# EAGLE design wespi-nano_3 (EAGLE 7.6.0)
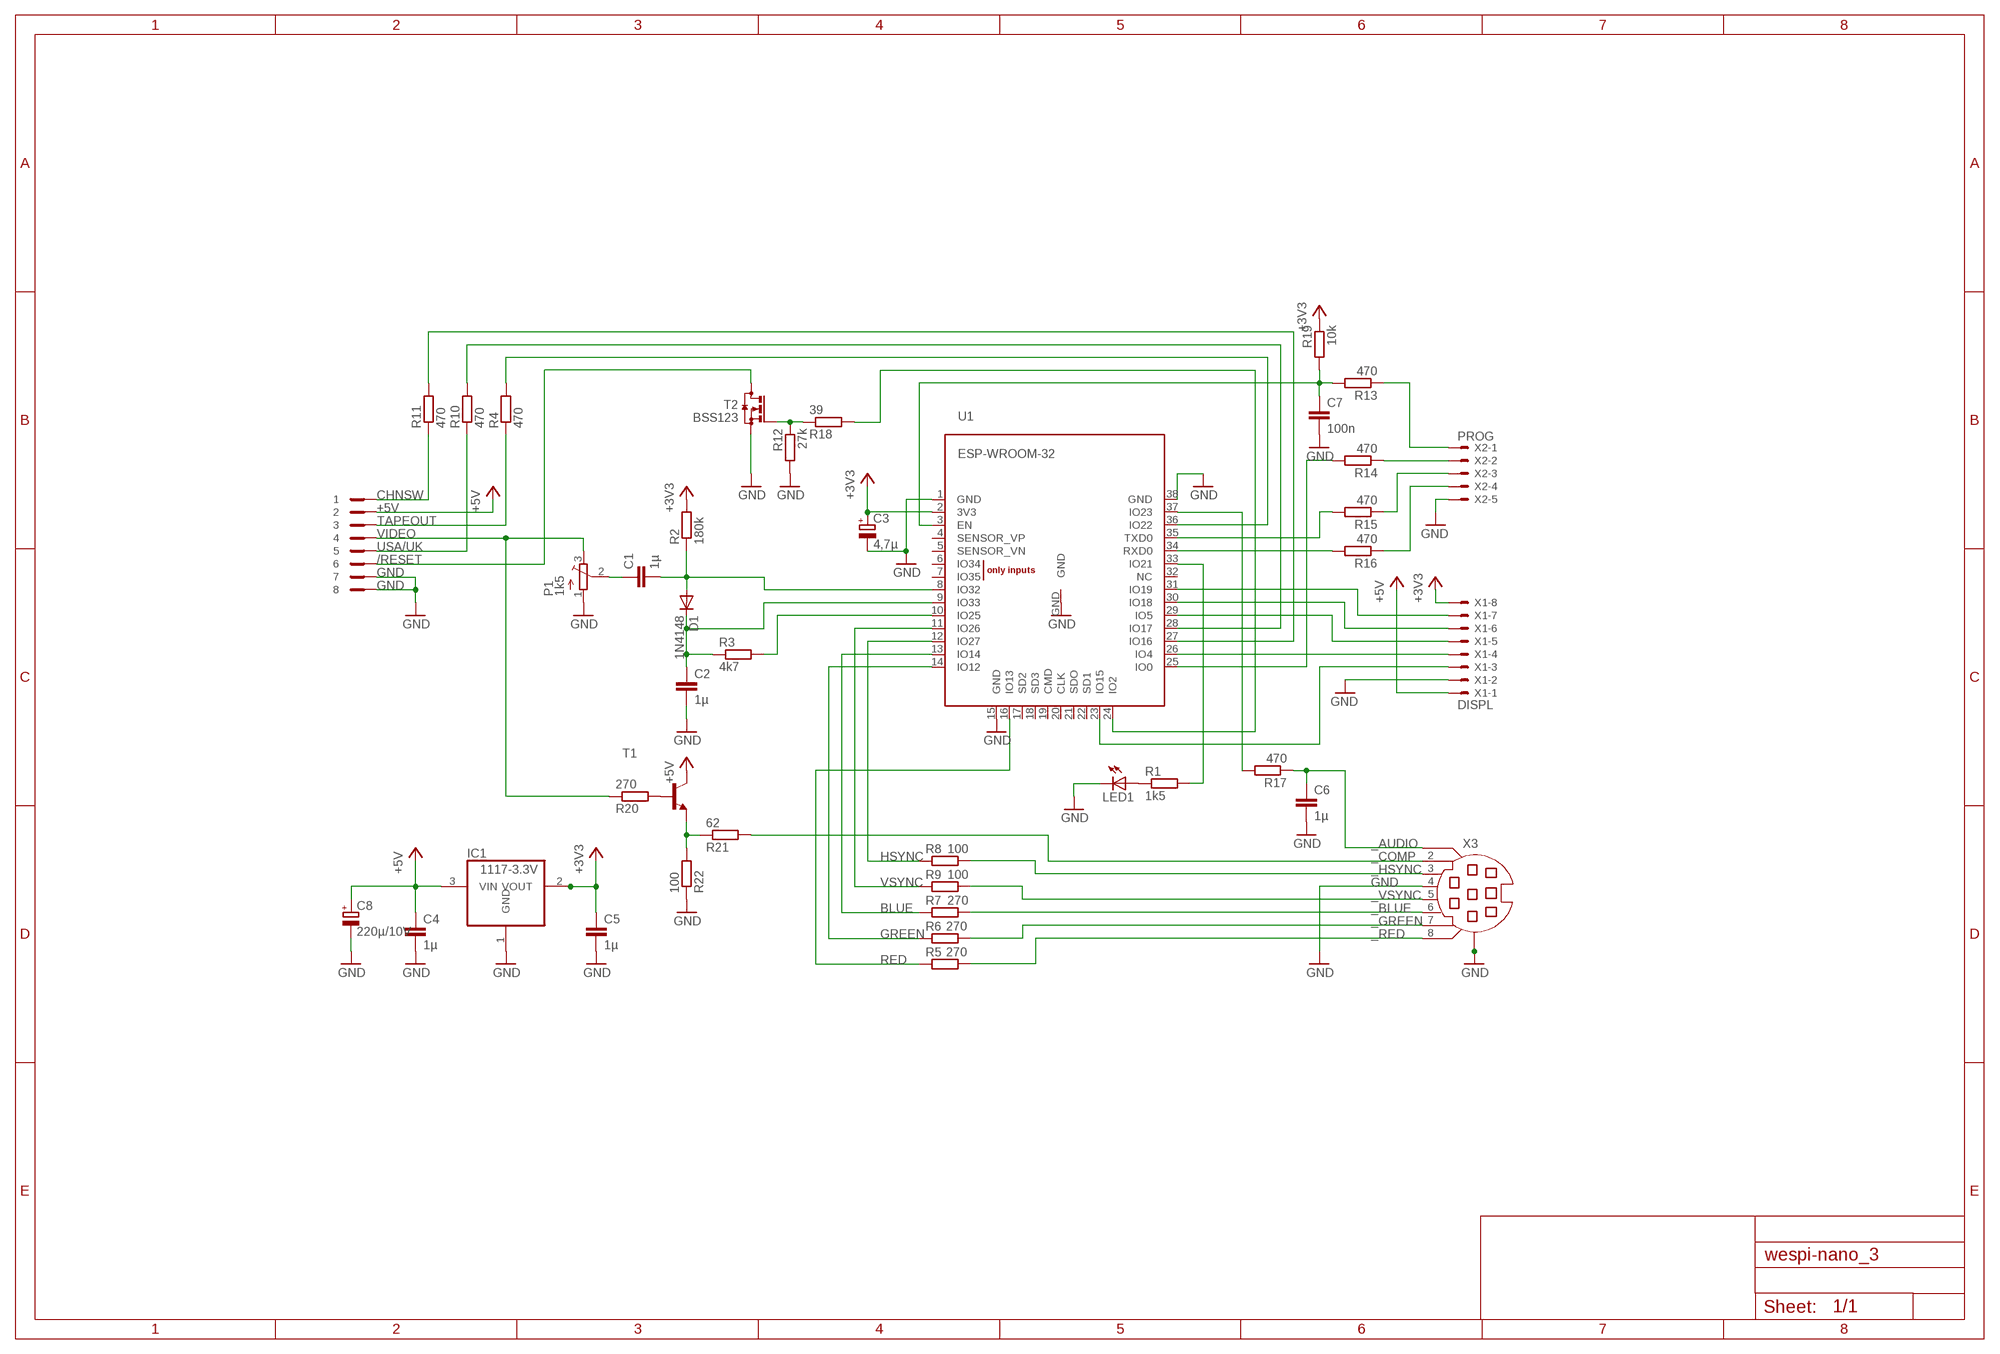
[diagram p0: schematic, sheet 1]

## Parts
C1  1µ  C-EUC0805  [C0805]
C2  1µ  C-EUC0805  [C0805]
C3  4,7µ  CPOL-EU153CLV-0405  [153CLV-0405]
C4  1µ  C-EUC0805  [C0805]
C5  1µ  C-EUC0805  [C0805]
C6  1µ  C-EUC0805  [C0805]
C7  100n  C-EUC0805  [C0805]
C8  220µ/10V  CPOL-EUE2.5-6  [E2,5-6]
D1  1N4148  CGRM4001-G  [SOD-123_MINI-SMA]
IC1  1117-3.3V  REG1117  [SOT223]
K6  PINHEAD-2X4  [PINHEAD2X4]
LED1  LEDSML0805  [SML0805]
P1  1k5  TRIM_EU-3223G  [3223G]
R1  1k5  R-EU_R0805  [R0805]
R2  180k  R-EU_R0805  [R0805]
R3  4k7  R-EU_R0805  [R0805]
R4  470  R-EU_R0805  [R0805]
R5  270  R-EU_R0805  [R0805]
R6  270  R-EU_R0805  [R0805]
R7  270  R-EU_R0805  [R0805]
R8  100  R-EU_R0805  [R0805]
R9  100  R-EU_R0805  [R0805]
R10  470  R-EU_R0805  [R0805]
R11  470  R-EU_R0805  [R0805]
R12  27k  R-EU_R0805  [R0805]
R13  470  R-EU_R0805  [R0805]
R14  470  R-EU_R0805  [R0805]
R15  470  R-EU_R0805  [R0805]
R16  470  R-EU_R0805  [R0805]
R17  470  R-EU_R0805  [R0805]
R18  39  R-EU_R0805  [R0805]
R19  10k  R-EU_R0805  [R0805]
R20  270  R-EU_R0805  [R0805]
R21  62  R-EU_R0805  [R0805]
R22  100  R-EU_R0805  [R0805]
T1  BC847-NPN-SOT23-BEC  [SOT23-BEC]
T2  BSS123  [SOT23]
U1  ESP-WROOM-32  [ESP-WROOM-32]
X1  DISPL  53047-08  [53047-08]
X2  PROG  53047-05  [53047-05]
X3  MINI-DIN-8  [MINI-DIN-8]

## Nets
+3V3: C3.+ C5.1 IC1.2(VOUT) IC1.4(VOUT1) R2.2 R19.1 U1.2(3V3) X1.8
+5V: C4.1 C8.+ IC1.3(VIN) K6.2 T1.C X1.1
/RESET: K6.6 T2.3(D)
_AUDIO: C6.1 R17.1 X3.1
_BLUE: R7.2 X3.6
_COMP: R21.2 X3.2
_GREEN: R6.2 X3.7
_HSYNC: R8.2 X3.3
_RED: R5.2 X3.8
_RESET: R13.1 X2.1
_RXD: R16.1 X2.4
_TXD: R15.1 X2.3
_VSYNC: R9.2 X3.5
BLUE: R7.1 U1.13(IO14)
BOOT0: R14.1 X2.2
CHNSW: K6.1 R11.1
GND: C2.2 C3.- C4.2 C5.2 C6.2 C7.2 C8.- IC1.1(GND) K6.7 K6.8 LED1.C P1.1(A) R12.2 R22.1 T2.2(S) U1.1(GND) U1.15(GND) U1.38(GND) U1.GND X1.2 X2.5 X3.4 X3.G1(G2) X3.G2(G3) X3.G(G1)
GREEN: R6.1 U1.14(IO12)
HSYNC: R8.1 U1.12(IO27)
IO0: R14.2 U1.25(IO0)
N$1: K6.3 R4.1
N$2: U1.23(IO15) X1.3
N$3: C1.2 D1.A R2.1 U1.8(IO32)
N$4: C2.1 D1.C R3.1 U1.9(IO33)
N$5: R3.2 U1.10(IO25)
N$6: R20.2 T1.B
N$7: R21.1 R22.2 T1.E
N$8: LED1.A R1.1
N$9: C1.1 P1.2(S)
N$10: R1.2 U1.33(IO21)
N$11: R18.2 U1.24(IO2)
N$12: U1.26(IO4) X1.4
N$13: R10.2 U1.28(IO17)
N$14: R11.2 U1.27(IO16)
N$15: U1.29(IO5) X1.5
N$16: U1.30(IO18) X1.6
N$17: U1.31(IO19) X1.7
N$26: R12.1 R18.1 T2.1(G)
N$27: R17.2 U1.37(IO23)
RED: R5.1 U1.16(IO13)
RESET: C7.1 R13.2 R19.2 U1.3(EN)
RXD0: R16.2 U1.34(RXD0)
TAPEOUT: R4.2 U1.36(IO22)
TXD0: R15.2 U1.35(TXD0)
USA/UK: K6.5 R10.1
VIDEO: K6.4 P1.3(E) R20.1
VSYNC: R9.1 U1.11(IO26)
Unconnected: U1.4(SENSOR_VP) U1.5(SENSOR_VN) U1.6(IO34) U1.7(IO35) U1.17(SD2) U1.18(SD3) U1.19(CMD) U1.20(CLK) U1.21(SDO) U1.22(SD1) U1.32(NC)

## Library data of the parts
C1 C2 C4-C7 = Thorsten_rcl:C-EU: CAPACITOR, European symbol
C3 = Thorsten_rcl:CPOL-EU: POLARIZED CAPACITOR, European symbol
C8 = rcl:CPOL-EU: POLARIZED CAPACITOR, European symbol
D1 = diode:CGRM400*-G: Molded plasitc,JEDEC SOD-123/Mini SMA Source: Comchip CGRM4001-G.pdf
IC1 = Thorsten_IC:REG1117
K6 = sinclair:PINHEAD-2X4
LED1 = led:LED: LED OSRAM: - CHIPLED LG R971, LG N971, LY N971, LG Q971, LY Q971, LO R971, LY R971 LH N974, LH R974 LS Q976, LO Q976, LY Q976 LO Q996 - Hyper CHIPLED LW Q18S LB Q993, LB Q99A, LB R99A - SideLED LS A670, LO A670, LY A670, LG A670, LP A670 LB A673, LV A673, LT A673, LW A673 LH A674 LY A675 LS A676, LA A676, LO A676, LY A676, LW A676 LS A679, LY A679, LG A679 - Hyper Micro SIDELED® LS Y876, LA Y876, LO Y876, LY Y876 LT Y87S - SmartLED LW L88C, LW L88S LB L89C, LB L89S, LG L890 LS L89K, LO L89K, LY L89K LS L896, LA L896, LO L896, LY L896 - TOPLED LS T670, LO T670, LY T670, LG T670, LP T670 LSG T670, LSP T670, LSY T670, LOP T670, LYG T670 LG T671, LOG T671, LSG T671 LB T673, LV T673, LT T673, LW T673 LH T674 LS T676, LA T676, LO T676, LY T676, LB T676, LH T676, LSB T676, LW T676 LB T67C, LV T67C, LT T67C, LS T67K, LO T67K, LY T67K, LW E67C LS E67B, LA E67B, LO E67B, LY E67B, LB E67C, LV E67C, LT E67C LW T67C LS T679, LY T679, LG T679 LS T770, LO T770, LY T770, LG T770, LP T770 LB T773, LV T773, LT T773, LW T773 LH T774 LS E675, LA E675, LY E675, LS T675 LS T776, LA T776, LO T776, LY T776, LB T776 LHGB T686 LT T68C, LB T68C - Hyper Mini TOPLED® LB M676 - Mini TOPLED Santana® LG M470 LS M47K, LO M47K, LY M47K Source: http://www.osram.convergy.de LUXEON: - LUMILED® LXK2-PW12-R00, LXK2-PW12-S00, LXK2-PW14-U00, LXK2-PW14-V00 LXK2-PM12-R00, LXK2-PM12-S00, LXK2-PM14-U00 LXK2-PE12-Q00, LXK2-PE12-R00, LXK2-PE12-S00, LXK2-PE14-T00, LXK2-PE14-U00 LXK2-PB12-K00, LXK2-PB12-L00, LXK2-PB12-M00, LXK2-PB14-N00, LXK2-PB14-P00, LXK2-PB14-Q00 LXK2-PR12-L00, LXK2-PR12-M00, LXK2-PR14-Q00, LXK2-PR14-R00 LXK2-PD12-Q00, LXK2-PD12-R00, LXK2-PD12-S00 LXK2-PH12-R00, LXK2-PH12-S00 LXK2-PL12-P00, LXK2-PL12-Q00, LXK2-PL12-R00 Source: www.luxeon.com KINGBRIGHT: KA-3528ASYC Source: www.kingbright.com
P1 = pot:TRIM_EU-: POTENTIOMETER
R1-R22 = Thorsten_rcl:R-EU_: RESISTOR, European symbol
T1 = transistor:*-NPN-: NPN Transistror BF959 corrected 2008.03.06
T2 = transistor-small-signal:BSS123: N-CHANNEL MOS FET
U1 = esp32:ESP-WROOM-32
X1 = con-molex:53?-08: CONNECTOR wire to board 1.25 mm (.049 inch) pitch header; MPN: 53047-0810; OC_FARNELL: 1012258; OC_NEWARK: 98K9826
X2 = con-molex:53?-05: CONNECTOR wire to board 1.25 mm (.049 inch) pitch header; MF: MOLEX; MPN: 53047-0510; OC_FARNELL: 9732861; OC_NEWARK: 38C9901
X3 = sinclair:MINI-DIN-8

## Board
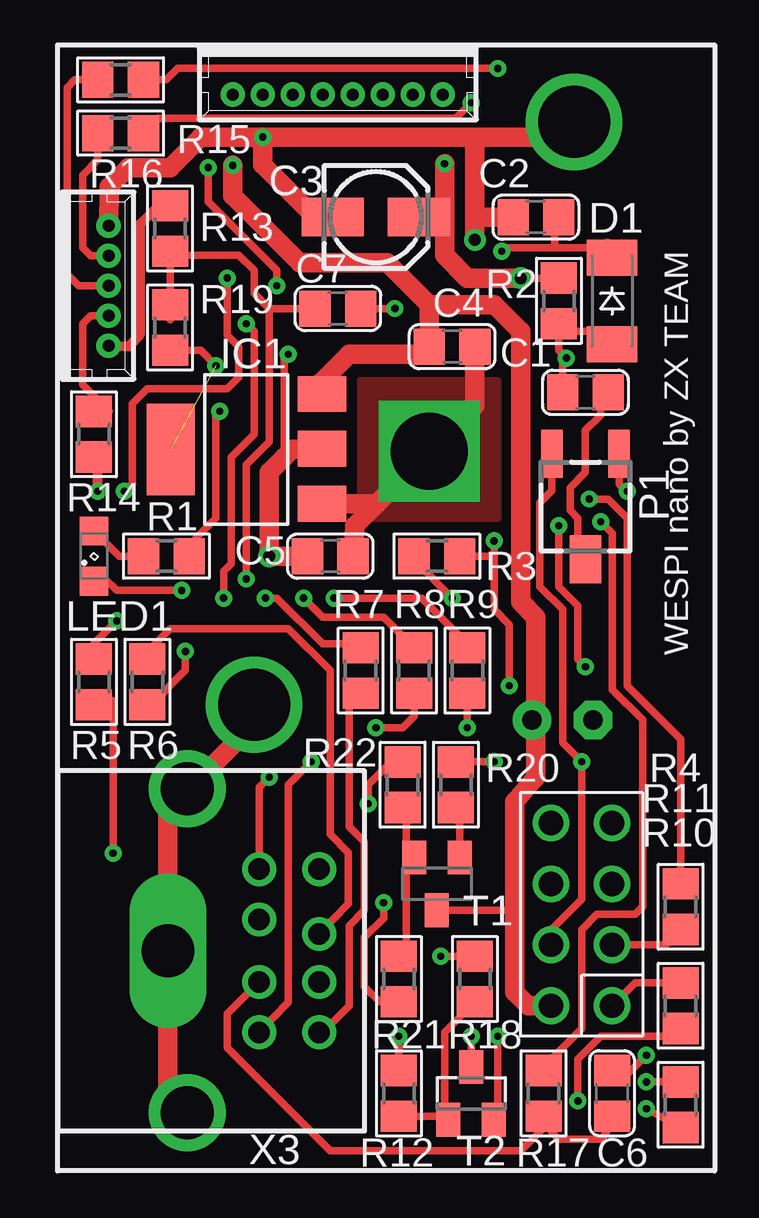
[diagram p1: board, top side]
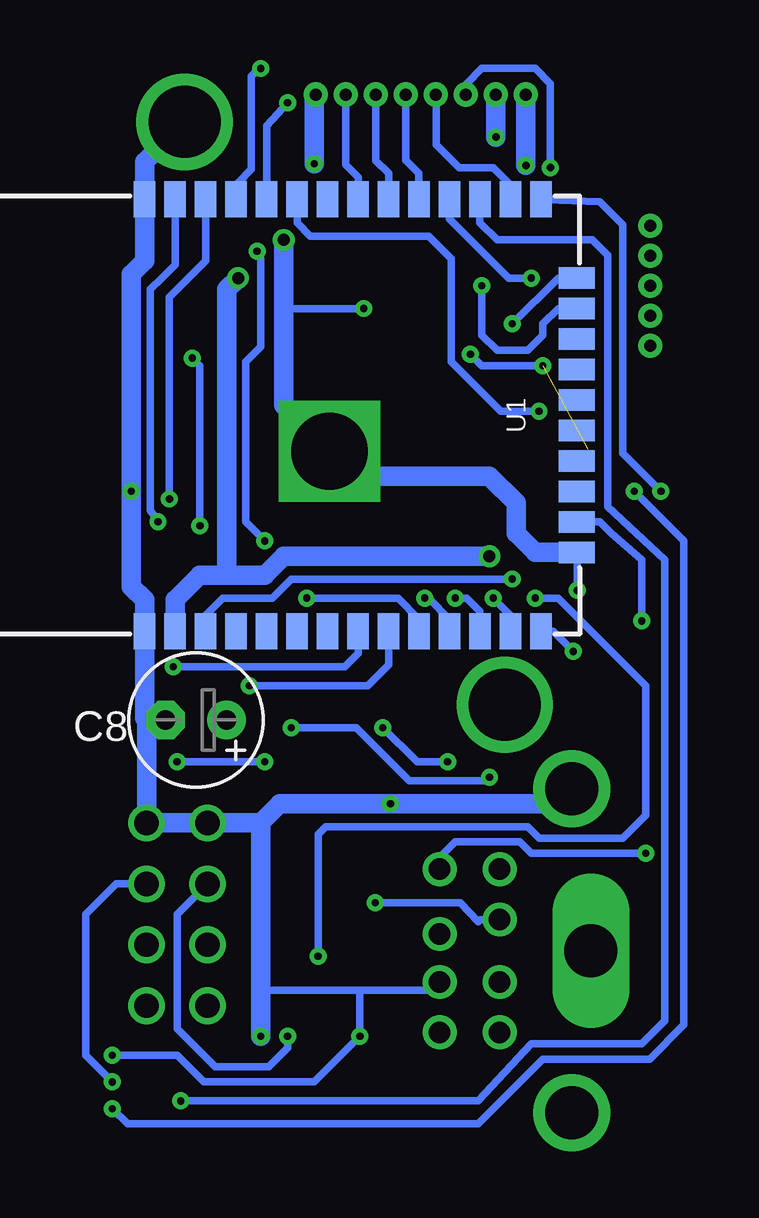
[diagram p2: board, bottom side, seen from below]

No outline drawn. Coordinates in mm, seen from the top.
Copper layers (1*16): Top 0.035mm / dielectric 1.5mm / Bottom 0.035mm
Design rules "default *": minimum track width 10mil, minimum drill 0.3mm, track to track 8mil, track to pad 8mil, pad to pad 8mil, via to via 8mil, smd to smd 8mil, copper to edge 40mil, drill to drill 8mil, minimum pad ring 10mil, minimum via ring 8mil, stop-mask expansion 4mil, vias tented up to drill 0.6mm, thermal gap 10mil

### Footprints (pad centres in the part's own frame; a part is rotated, then mirrored left to right if it is on the bottom)
C0805 = smd 1.3 x 1.5: 1 -0.95,0; 2 0.95,0
153CLV-0405 = smd 2.6 x 1.6: + 1.8,0; - -1.8,0
E2,5-6 = drill 0.813 pad 1.6: + -1.27,0 | drill 0.813 pad 1.6 octagon: - 1.27,0
SOD-123_MINI-SMA = smd 1.5 x 2.1: A 1.8,0; C -1.8,0
SOT223 = smd 1.499 x 2.007: 1 -2.261,-3.15; 2 0.025,-3.15; 3 2.311,-3.15 | smd 3.81 x 2.007: 4 0,3.15
PINHEAD2X4 = drill 1.016: 1 -7.62,0; 2 -7.62,2.54; 3 -5.08,0; 4 -5.08,2.54; 5 -2.54,0; 6 -2.54,2.54; 7 0,0; 8 0,2.54
SML0805 = smd 1.2 x 1.2: A 1.05,0; C -1.05,0
3223G = smd 2 x 0.9: 1 -2.2,1.4; 3 -2.2,-1.4 | smd 2 x 1.3: 2 2.2,0
R0805 = smd 1.3 x 1.5: 1 -0.95,0; 2 0.95,0
SOT23-BEC = smd 1 x 1.4: B -0.95,-1.1; C 0,1.1; E 0.95,-1.1
SOT23 = smd 1 x 1.4: 1 -0.95,-1.1; 2 0.95,-1.1; 3 0,1.1
ESP-WROOM-32 = smd 0.9 x 1.5: 1 7.7,9; 2 6.43,9; 3 5.16,9; 4 3.89,9; 5 2.62,9; 6 1.35,9; 7 0.08,9; 8 -1.19,9; 9 -2.46,9; 10 -3.73,9; 11 -5,9; 12 -6.27,9; 13 -7.54,9; 14 -8.81,9; 25 -8.81,-9; 26 -7.54,-9; 27 -6.27,-9; 28 -5,-9; 29 -3.73,-9; 30 -2.46,-9; 31 -1.19,-9; 32 0.08,-9; 33 1.35,-9; 34 2.62,-9; 35 3.89,-9; 36 5.16,-9; 37 6.43,-9; 38 7.7,-9 | smd 1.5 x 0.9: 15 -10.3,5.715; 16 -10.3,4.445; 17 -10.3,3.175; 18 -10.3,1.905; 19 -10.3,0.635; 20 -10.3,-0.635; 21 -10.3,-1.905; 22 -10.3,-3.175; 23 -10.3,-4.445; 24 -10.3,-5.715 | drill 3.2 pad 3.81 square: GND 0,1.5
53047-08 = drill 0.5 pad 0.698: 1 4.375,0.45; 2 3.125,0.45; 3 1.875,0.45; 4 0.625,0.45; 5 -0.625,0.45; 6 -1.875,0.45; 7 -3.125,0.45; 8 -4.375,0.45
53047-05 = drill 0.5: 1 2.5,0.45; 2 1.25,0.45; 3 0,0.45; 4 -1.25,0.45; 5 -2.5,0.45
MINI-DIN-8 = drill 0.9: 1 1.3,8.4; 2 -1.3,8.4; 3 3.4,8.4; 4 1.3,10.9; 5 -3.4,8.4; 6 3.4,10.9; 7 -0.7,10.9; 8 -3.4,10.9 | drill 2.2 long: G 0,4.6 | drill 2.2: G1 -6.75,5.4; G2 6.75,5.4

### Placement (x,y rotation side)
C1  20.48,30.64 180 top
C2  18.41,37.94 180 top
C3  11.75,37.94 0 top
C4  14.92,32.54 0 top
C5  9.84,23.81 0 top
C6  21.59,1.43 90 top
C7  10.16,34.13 0 top
C8  19.53,16.99 180 bottom
D1  21.59,34.45 270 top
IC1  6.35,28.26 90 top
K6  21.59,12.7 90 top
LED1  0,23.81 90 top
P1  20.48,25.88 270 top
R1  3.02,23.81 0 top
R2  19.37,34.45 90 top
R3  14.29,23.81 180 top
R4  24.45,9.21 90 top
R5  0,18.57 270 top
R6  2.22,18.57 90 top
R7  11.11,19.05 270 top
R8  13.34,19.05 270 top
R9  15.56,19.05 270 top
R10  24.45,0.95 270 top
R11  24.45,5.08 270 top
R12  12.7,1.43 90 top
R13  3.17,37.47 270 top
R14  0,28.89 270 top
R15  1.11,43.66 0 top
R16  1.11,41.43 0 top
R17  18.73,1.43 90 top
R18  15.88,6.19 90 top
R19  3.17,33.34 90 top
R20  15.08,14.29 270 top
R21  12.7,6.19 270 top
R22  12.86,14.29 270 top
T1  14.29,10.16 180 top
T2  15.72,1.43 0 top
U1  13.97,29.69 180 bottom
X1  10.16,43.5 180 top
X2  0.16,35.08 270 top
X3  -1.52,7.37 270 top

### Tracks (layer width: path | path; a pad name or v marks a point on that pad's centre or on a via)
+3V3  (via drill 0.3, 0.5)  (1 unrouted)
  Top 0.305: 9.47,28.26 IC1.2 | R2.2 18.73,35.4 18.41,35.4 v17.78,35.4 | R19.1 4.45,32.38 v5.08,31.75 | v8.1,32.23 7.94,32.07 7.94,27.94
  Top 0.813: 9.47,28.26 8.26,28.26 7.94,27.94 7.3,27.3 v7.3,23.81 C5.1 | v17.78,35.4 15.56,35.4 14.61,36.35 14.61,37.31 | 14.61,37.31 v14.61,40.16 | C3.+ 14.29,37.62 14.61,37.31
  Bottom 0.305: v5.08,31.75 7.62,31.75 v8.1,32.23
  Bottom 0.813: U1.2 20.4,21.99 19.37,23.02 18.26,23.02 | 18.26,23.02 16.67,23.02 15.88,23.81 v7.3,23.81 | 18.26,23.02 18.26,34.92 v17.78,35.4 | v14.61,40.16 14.61,42.98 X1.8
+5V  (via drill 0.3)
  Top 0.305: T1.C 17.05,9.06 17.54,9.05
  Top 0.813: K6.2 18.1,5.08 17.54,5.64 17.54,9.05 17.54,13.57 18.41,14.61 18.41,16.99 | 18.41,16.99 18.41,21.27 17.78,21.91 17.78,33.18 16.67,34.29 13.97,34.29 | 13.97,34.29 12.22,36.04 8.57,36.04 5.79,38.82 v5.79,40.09 | IC1.3 9.5,31.09 10.64,32.23 13.65,32.23 C4.1 13.97,34.29 | C8.+ 18.41,16.99
  Bottom 0.813: X1.1 v5.79,40.09
/RESET  (via drill 0.3)
  Top 0.305: T2.3 v15.72,3.81
  Bottom 0.305: v15.72,3.81 15.72,3.33 16.51,2.54 18.73,2.54 20.32,4.13 20.32,8.89 K6.6
_AUDIO
  Top 0.305: X3.1 5.56,4.75 5.56,3.33 9.84,-0.95 17.78,-0.95 18.73,0 R17.1 19.05,0 19.05,-0.16 19.37,-0.48 21.11,-0.48 21.27,-0.32 C6.1
_BLUE
  Top 0.305: R7.2 10.64,17.62 10.64,12.54 11.27,11.91 11.27,9.05 10.64,8.41 10.64,5.08 9.53,3.97 X3.6
_COMP  (via drill 0.3)
  Top 0.305: v12.06,9.37 12.06,8.73 11.27,7.94 11.27,5.87 11.91,5.24 R21.2
  Bottom 0.305: X3.2 7.68,8.67 7.78,8.57 8.53,9.37 v12.06,9.37
_GREEN
  Top 0.305: X3.7 10.6,9.32 10.6,11.46 9.84,12.22 9.84,19.05 8.1,20.8 3.17,20.8 2.38,20 R6.2
_HSYNC  (via drill 0.3)
  Top 0.305: v9.05,15.24 8.1,14.29 8.1,5.23 X3.3 | v11.75,16.67 12.86,16.67 13.34,17.14 R8.2
  Bottom 0.305: v9.05,15.24 10.32,15.24 v11.75,16.67
_RED  (via drill 0.3)
  Top 0.305: v0.79,11.43 0.79,17.78 R5.2
  Bottom 0.305: X3.8 9.38,11.26 8.73,11.91 6.03,11.91 5.56,11.43 v0.79,11.43
_RESET
  Top 0.406: R13.1 2.7,38.41 1.91,37.62 1.91,33.02 1.44,32.54 X2.1
_RXD
  Top 0.305: X2.4 -0.14,36.33 -0.48,36.67 -0.48,39.69 0.16,40.32 R16.1
_TXD
  Top 0.305: X2.3 -0.64,35.08 -1.11,35.56 -1.11,43.34 -0.79,43.66 R15.1
_VSYNC  (via drill 0.3)
  Top 0.305: R9.2 15.56,17.78 v15.56,16.67 | v7.3,14.61 6.88,14.18 X3.5
  Bottom 0.305: v15.56,16.67 12.86,16.67 10.64,14.45 7.46,14.45 v7.3,14.61
BLUE  (via drill 0.3)
  Top 0.305: v7.14,22.07 7.62,22.07 9.53,20.16 10.95,20.16 R7.1
  Bottom 0.305: U1.13 6.43,21.35 v7.14,22.07
BOOT0
  Top 0.305: R14.1 0.64,29.84 -0.48,30.96 -0.48,33.5 -0.14,33.83 X2.2
CHNSW
  Top 0.305: R11.1 22.54,6.03 K6.1
GND  (via drill 0.3, 0.5, 3)
  Top 0.305: C7.2 v12.54,34.13 | v23.02,3.02 22.23,2.22 21.75,2.22 C6.2 | T2.2 16.83,0.49 v16.83,3.81 | R12.2 v12.7,3.81 | R22.1 12.38,15.24 11.43,14.29 v11.43,13.49 | LED1.C 0.41,22.92 0.95,22.38 v3.65,22.38 | P1.1 21.88,26.8 v22.23,26.51
  Top 0.813: v7.04,41.27 15.88,41.27 | v15.88,36.99 15.88,37.94 | 15.88,37.94 15.88,39.69 | 15.88,39.69 15.88,41.27 | C3.- 9.53,37.62 7.04,40.11 v7.04,41.27 | C5.2 10.87,25.08 11.78,26 | IC1.1 11.78,26 | 11.78,26 U1.GND 15.87,30.09 C4.2 | 15.88,39.37 15.88,39.69 | X3.G2 3.08,1.42 X3.G 3.08,13.32 X3.G1 3.96,14.12 6.67,16.83 v6.67,17.62 | v20,41.91 19.37,41.27 15.88,41.27 | C2.2 15.88,37.94 | X2.5 0.64,39.21 1.43,40.01 3.17,40.01 4.45,41.27 v7.04,41.27
  Bottom 0.305: 12.7,5.71 v12.7,3.81 14.61,1.91 19.21,1.91 20.32,3.02 v23.02,3.02 | X3.4 9.38,6.02 9.68,5.71 12.7,5.71 | 12.7,5.71 16.83,5.71 | v12.54,34.13 15.88,34.13 | v3.65,22.38 3.65,23.95 U1.15
  Bottom 0.813: K6.7 K6.8 16.83,12.7 | K6.7 21.67,12.78 | U1.15 5.4,23.97 6.19,24.77 6.19,26.04 7.3,27.15 12.93,27.15 U1.GND 15.88,30.09 15.88,30.16 | v15.88,36.99 15.88,34.13 15.88,30.16 | 15.88,30.16 15.56,29.84 | 7.04,43.07 X1.2 v7.04,41.27 | 16.83,12.7 16.03,13.49 v11.43,13.49 4.51,13.49 X3.G1 | v16.83,3.81 16.83,5.71 16.83,12.7 | v20,41.91 21.67,40.24 U1.38 21.67,36.12 22.23,35.56 v22.23,26.51 22.23,22.54 21.67,21.99 U1.1 21.67,17.07 | 21.67,17.07 C8.- | K6.7 21.59,16.99 21.67,17.07
  pour Top (no thermals): 11.11,31.11 16.83,31.11 16.83,25.4 11.11,25.4
GREEN  (via drill 0.3)
  Top 0.305: R6.1 2.38,17.62 3.81,19.05 v3.81,19.84
  Bottom 0.305: U1.14 4.65,20.69 v3.81,19.84
HSYNC  (via drill 0.3)
  Top 0.305: v8.73,22.07 9.53,21.27 12.06,21.27 R8.1
  Bottom 0.305: U1.12 7.7,21.51 8.26,22.07 v8.73,22.07
IO0  (via drill 0.3)
  Top 0.406: v0.16,26.51 0.16,27.78 R14.2
  Bottom 0.305: v0.16,26.51 1.75,28.1 1.75,37.62 2.7,38.58 5,38.66 U1.25
N$1
  Top 0.305: K6.3 23.82,7.62 R4.1
N$2  (via drill 0.3)
  Top 0.305: v7.62,35.08 7.62,35.72 4.76,38.58 v4.76,40.01
  Bottom 0.305: U1.23 4.45,34.13 5.08,33.5 5.08,33.02 5.71,32.38 6.99,32.38 7.62,33.02 v7.62,35.08 | v4.76,40.01 4.76,43.5 5.4,44.13 7.62,44.13 8.26,43.5 8.26,43.08 X1.3
N$3  (via drill 0.3)
  Top 0.305: C1.2 19.53,31.91 v19.68,32.07 19.37,32.39 R2.1 19.68,33.18 21.06,33.18 D1.A | v20.48,19.21 20.16,19.53 20.16,21.75 19.37,22.54 v19.37,25.08
  Bottom 0.305: v20.48,19.21 13.34,19.21 12.78,19.76 U1.8 | v19.37,25.08 19.37,31.75 v19.68,32.07
N$4  (via drill 0.3)
  Top 0.305: 21.38,36.88 D1.C 21.17,36.67 19.21,36.67 | v16.99,36.51 17.14,36.67 19.21,36.67 | C2.1 19.36,38.1 19.21,37.94 19.21,36.67 | v17.3,18.41 17.3,20.95 16.67,21.59 16.67,23.81 | R3.1 16.67,23.81 | 16.67,23.81 v16.67,24.45
  Bottom 0.305: U1.9 11.51,19.29 12.38,18.41 v17.3,18.41 | v16.99,36.51 16.83,36.2 16.83,32.54 17.46,31.91 17.46,25.24 v16.67,24.45
N$5  (via drill 0.3)
  Top 0.305: v14.92,22.07 13.34,23.65 R3.2
  Bottom 0.305: U1.10 10.24,21.19 11.11,22.07 v14.92,22.07
N$6
  Top 0.305: R20.2 15.24,13.17 T1.B
N$7
  Top 0.305: R21.1 13.02,7.46 13.02,11.27 | 13.02,11.27 13.02,13.02 R22.2 | T1.E 13.02,11.27
N$8
  Top 0.305: R1.1 1.05,23.81 LED1.A
N$9
  Top 0.305: C1.1 21.11,30.8 21.11,29.69 20.48,29.05 20.48,27.3 19.84,26.67 19.84,25.72 20.16,25.4 20.16,23.99 P1.2
N$10  (via drill 0.3)
  Top 0.305: v5.24,29.84 5.08,29.69 5.08,25.4 4.29,24.61 R1.2
  Bottom 0.305: U1.33 15.32,37.7 14.76,37.15 9.84,37.15 8.89,36.2 8.89,31.91 6.83,29.84 v5.24,29.84
N$11  (via drill 0.3)
  Top 0.305: v6.35,33.5 6.67,33.18 6.67,28.89 5.71,27.94 5.71,23.5 5.4,23.18 v5.4,22.07 | R18.2 15.4,7.14 v14.45,7.14
  Bottom 0.305: U1.24 4.45,35.4 v6.35,33.5 | v5.4,22.07 4.45,22.07 0.79,18.41 0.79,13.02 1.75,12.06 5.24,12.06 5.71,12.54 14.13,12.54 14.45,12.22 v14.45,7.14
N$12
  Bottom 0.305: U1.26 6.43,39.29 7.14,40.01 8.57,40.01 9.53,40.96 9.53,43.04 X1.4
N$13  (via drill 0.3)
  Top 0.305: R10.2 v23.02,0.79 | v5.56,35.4 5.56,33.02 6.03,32.54 6.03,31.27 5.56,30.8 2.22,30.8 1.59,30.16 1.59,26.83 v1.27,26.51
  Bottom 0.305: U1.28 8.97,37.86 6.51,35.4 v5.56,35.4 | v23.02,0.79 22.38,0.16 7.78,0.16 5.08,2.86 0.64,2.86 -0.79,4.29 -0.79,24.45 v1.27,26.51
N$14  (via drill 0.3)
  Top 0.305: R11.2 24.13,3.81 21.11,3.81 20.16,2.86 v20.16,1.11
  Bottom 0.305: v20.16,1.11 7.78,1.11 5.56,3.49 0.95,3.49 0,4.45 0,23.65 2.38,25.88 2.38,36.35 3.02,36.99 6.99,36.99 7.7,37.7 U1.27
N$15
  Bottom 0.305: U1.29 10.24,39.77 10.79,40.31 X1.5
N$16
  Bottom 0.305: U1.30 11.51,39.77 12.04,40.29 X1.6
N$17
  Bottom 0.305: U1.31 12.78,39.61 13.29,40.11 X1.7
N$26
  Top 0.305: R18.1 14.61,3.97 14.61,0.49 T2.1 14.62,0.48 R12.1
N$27  (via drill 0.3)
  Top 0.305: v21.11,25.24 21.59,24.77 21.59,18.26 22.86,16.99 22.86,9.21 22.54,8.89 20.95,8.89 20.32,8.26 20.32,4.13 18.73,2.54 R17.2
  Bottom 0.305: U1.37 20.4,35.96 20.95,35.4 21.43,34.92 21.43,25.72 v21.11,25.24
RED  (via drill 0.3)
  Top 0.305: R5.1 0,20.16 v0.95,21.11
  Bottom 0.305: U1.16 2.7,25.24 2.22,24.77 0.95,23.65 v0.95,21.11
RESET  (via drill 0.3)
  Top 0.305: v6.35,22.86 6.35,27.62 7.3,28.57 7.3,34.13 | 7.3,34.13 6.67,34.77 6.67,35.72 6.03,36.35 3.65,36.35 R13.2 3.18,34.61 3.18,33.66 R19.2 | C7.1 7.3,34.13
  Bottom 0.305: U1.3 19.13,21.35 18.41,22.07 16.35,22.07 15.56,22.86 v6.35,22.86
RXD0  (via drill 0.3)
  Top 0.305: v15.72,42.7 15.08,42.07 2.7,42.07 R16.2
  Bottom 0.305: U1.34 16.59,41.75 v15.72,42.7
TAPEOUT  (via drill 0.3)
  Top 0.305: v20.64,26.19 21.43,26.19 22.23,25.4 22.23,18.41 24.45,16.19 R4.2
  Bottom 0.305: v20.64,26.19 20.64,34.61 19.13,36.12 U1.36
TXD0  (via drill 0.3)
  Top 0.305: R15.2 3.02,43.66 3.49,44.13 v16.83,44.13
  Bottom 0.305: U1.35 17.78,38.69 17.78,39.37 17.23,39.92 17.23,43.81 16.91,44.13 v16.83,44.13
USA/UK  (via drill 0.3)
  Top 0.305: v23.02,1.91 R10.1
  Bottom 0.305: K6.5 22.86,10.16 24.13,8.89 24.13,3.02 v23.02,1.91
VIDEO  (via drill 0.3)
  Top 0.305: K6.4 19.05,8.26 20.32,9.53 v20.32,15.24 19.53,16.03 19.53,21.59 18.57,22.54 18.57,26.04 19.08,26.54 P1.3 | R20.1 v16.67,15.24
  Bottom 0.305: v16.67,15.24 v20.32,15.24
VSYNC  (via drill 0.3)
  Top 0.305: v10,22.07 13.65,22.07 15.56,20.16 R9.1
  Bottom 0.305: U1.11 8.97,21.19 9.84,22.07 v10,22.07

### Text on the board
tPlace: WESPI nano by ZX TEAM